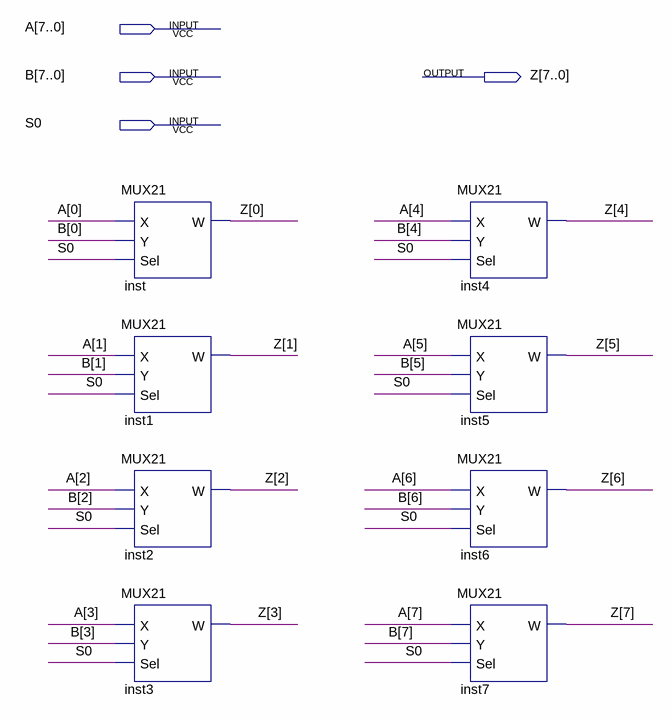
[diagram p0: schematic sheet]
// Quartus schematic MUX21_8x.bdf as structural Verilog: 8 symbols, 4 pins
module MUX21_8x (
  input  [7:0] A,
  input  [7:0] B,
  input  S0,
  output [7:0] Z
);

  MUX21 inst (.X(A[0]), .Y(B[0]), .Sel(S0), .W(Z[0]));
  MUX21 inst1 (.X(A[1]), .Y(B[1]), .Sel(S0), .W(Z[1]));
  MUX21 inst2 (.X(A[2]), .Y(B[2]), .Sel(S0), .W(Z[2]));
  MUX21 inst3 (.X(A[3]), .Y(B[3]), .Sel(S0), .W(Z[3]));
  MUX21 inst4 (.X(A[4]), .Y(B[4]), .Sel(S0), .W(Z[4]));
  MUX21 inst5 (.X(A[5]), .Y(B[5]), .Sel(S0), .W(Z[5]));
  MUX21 inst6 (.X(A[6]), .Y(B[6]), .Sel(S0), .W(Z[6]));
  MUX21 inst7 (.X(A[7]), .Y(B[7]), .Sel(S0), .W(Z[7]));
endmodule
